# Altium schematic sheet LED_Drivers.SchDoc: LED Drivers
size B; Date: 9/29/2024; Author: Sam Tomlinson; Organization: UWRT; Address1: ADDRESS 1; Address2: ADDRESS 2; Address3: ADDRESS 3; Address4: ADDRESS 4; Revision: -; SheetNumber: 2; SheetTotal: 4; ENG_APP_DATE: --/--/--; DSN_APP_DATE: --/--/--; CHK_APP_DATE: --/--/--; TeamLead: John Ulm
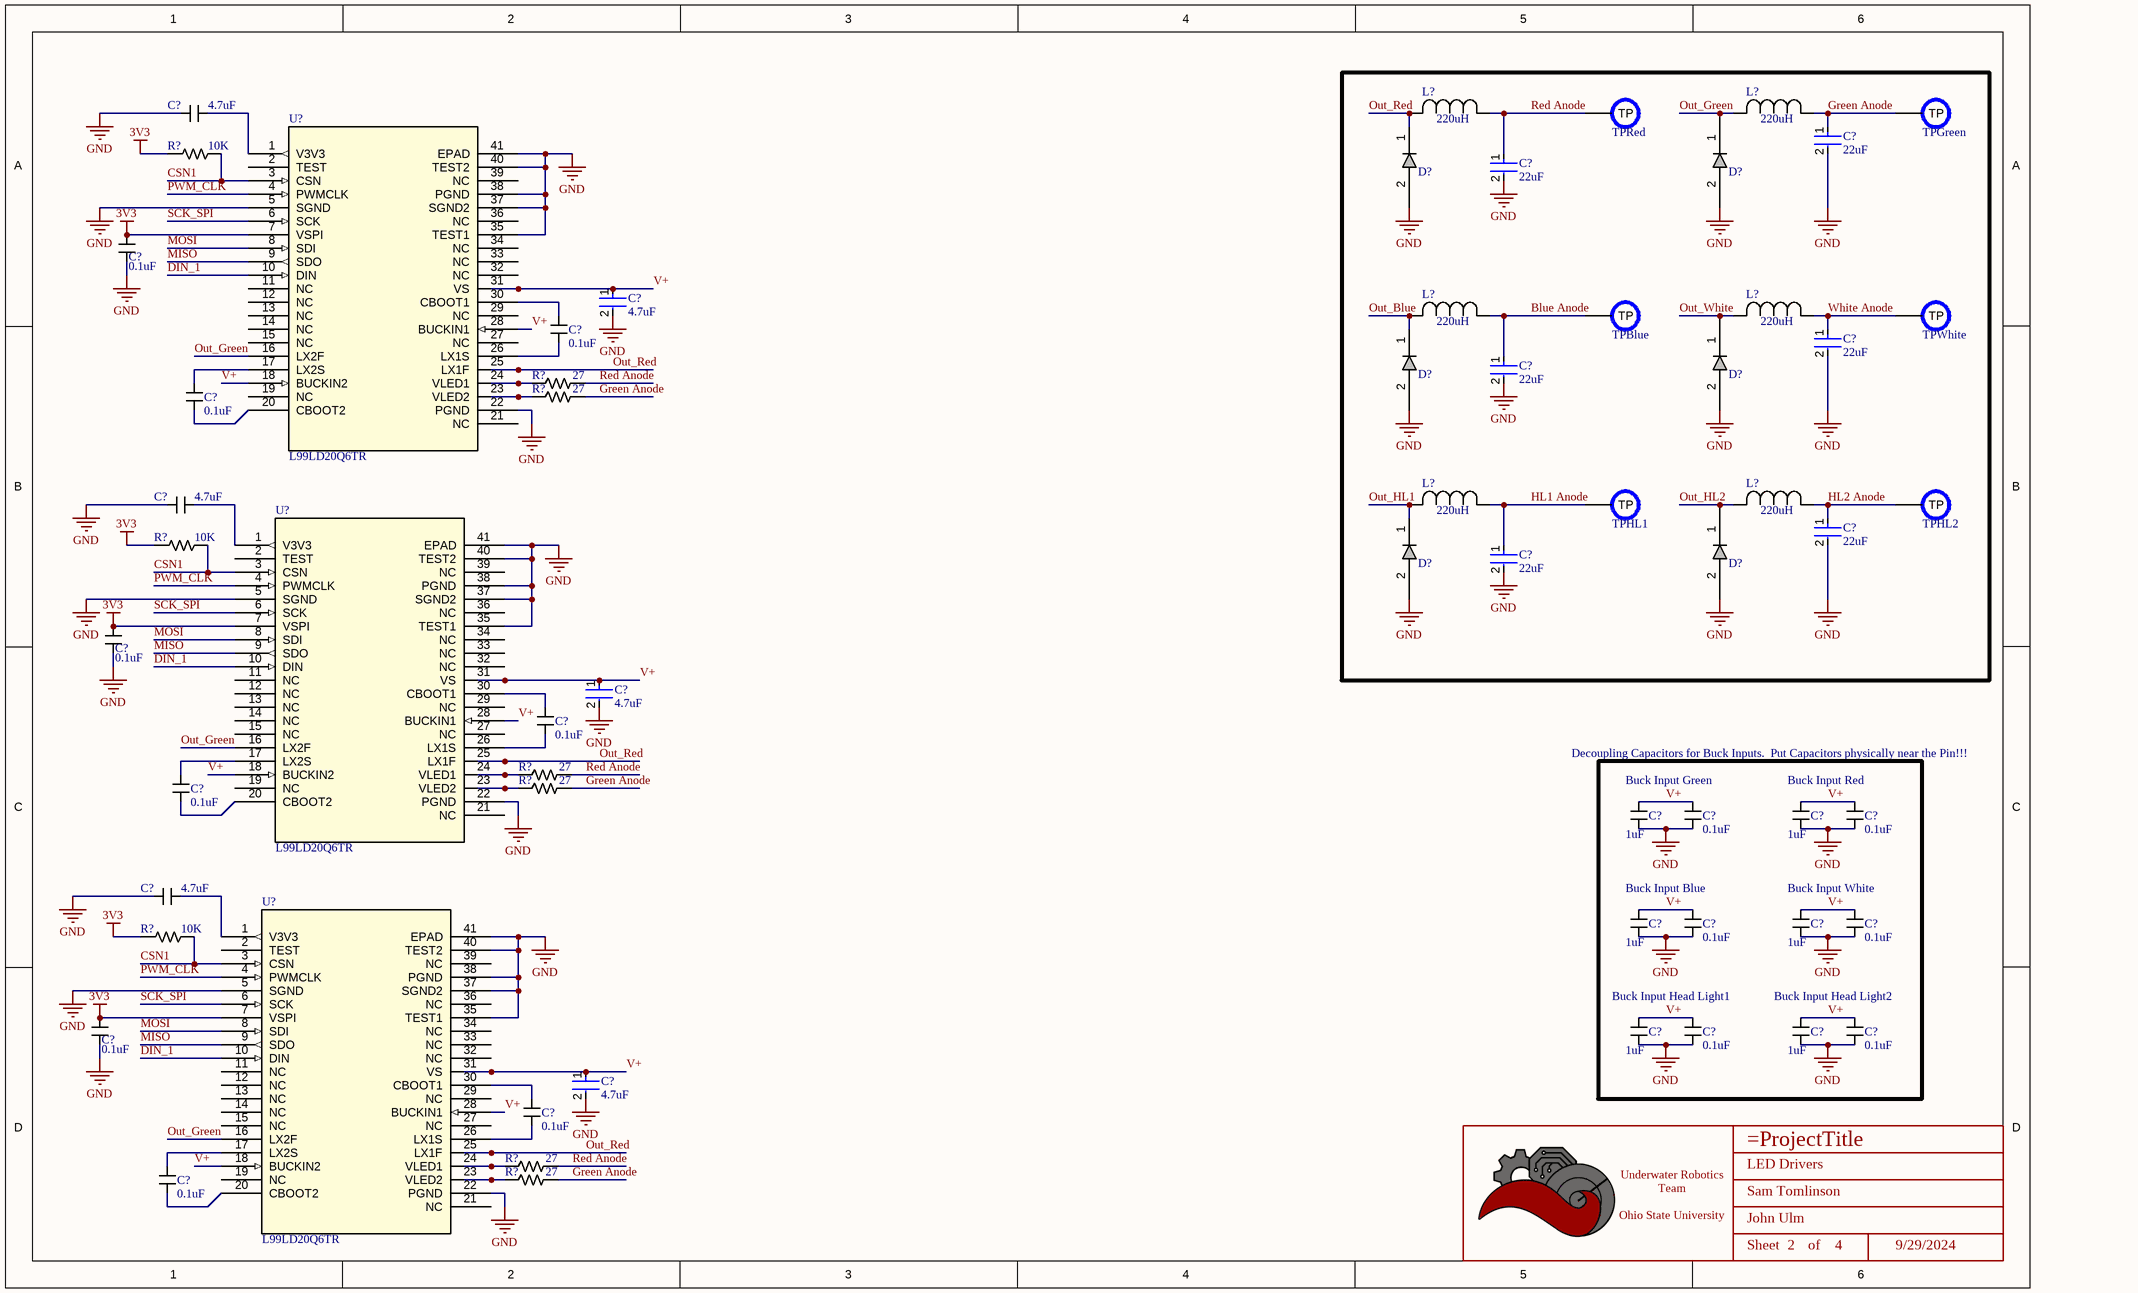
[diagram p0: LED_Drivers.SchDoc]

## Parts
(Parts that share a designator on the sheet are numbered #1, #2 ... from top to bottom, then left to right.)
*  Title_Block  [LOGO]  (value not drawn)  (graphical)
C?#1  value 4.7uF  [CAPACITOR_0603]  (hidden comment: 4.7uF Ceramic 6.3V)
C?#2  22uF  [FP-C2012-125-0_2-MFG]
C?#3  22uF  [FP-C2012-125-0_2-MFG]
C?#4  value 0.1uF  [CAPACITOR_0603]  (hidden comment: 100nF Ceramic 6.3V)
C?#5  4.7uF  [CAPACITOR_0603]
C?#6  value 0.1uF  [CAPACITOR_0603]  (hidden comment: 100nF Ceramic 25V)
C?#7  22uF  [FP-C2012-125-0_2-MFG]
C?#8  22uF  [FP-C2012-125-0_2-MFG]
C?#9  value 0.1uF  [CAPACITOR_0603]  (hidden comment: 100nF Ceramic 25V)
C?#10  value 4.7uF  [CAPACITOR_0603]  (hidden comment: 4.7uF Ceramic 6.3V)
C?#11  22uF  [FP-C2012-125-0_2-MFG]
C?#12  22uF  [FP-C2012-125-0_2-MFG]
C?#13  value 0.1uF  [CAPACITOR_0603]  (hidden comment: 100nF Ceramic 6.3V)
C?#14  4.7uF  [CAPACITOR_0603]
C?#15  value 0.1uF  [CAPACITOR_0603]  (hidden comment: 100nF Ceramic 25V)
C?#16  value 0.1uF  [CAPACITOR_0603]  (hidden comment: 100nF Ceramic 25V)
C?#17  value 1uF  [CAPACITOR_0603]  (hidden comment: 1uF Ceramic 25V)
C?#18  value 0.1uF  [CAPACITOR_0603]  (hidden comment: 100nF Ceramic 25V)
C?#19  value 1uF  [CAPACITOR_0603]  (hidden comment: 1uF Ceramic 25V)
C?#20  value 0.1uF  [CAPACITOR_0603]  (hidden comment: 100nF Ceramic 25V)
C?#21  value 4.7uF  [CAPACITOR_0603]  (hidden comment: 4.7uF Ceramic 6.3V)
C?#22  value 1uF  [CAPACITOR_0603]  (hidden comment: 1uF Ceramic 25V)
C?#23  value 0.1uF  [CAPACITOR_0603]  (hidden comment: 100nF Ceramic 25V)
C?#24  value 1uF  [CAPACITOR_0603]  (hidden comment: 1uF Ceramic 25V)
C?#25  value 0.1uF  [CAPACITOR_0603]  (hidden comment: 100nF Ceramic 25V)
C?#26  value 0.1uF  [CAPACITOR_0603]  (hidden comment: 100nF Ceramic 6.3V)
C?#27  value 1uF  [CAPACITOR_0603]  (hidden comment: 1uF Ceramic 25V)
C?#28  value 0.1uF  [CAPACITOR_0603]  (hidden comment: 100nF Ceramic 25V)
C?#29  value 1uF  [CAPACITOR_0603]  (hidden comment: 1uF Ceramic 25V)
C?#30  value 0.1uF  [CAPACITOR_0603]  (hidden comment: 100nF Ceramic 25V)
C?#31  4.7uF  [CAPACITOR_0603]
C?#32  value 0.1uF  [CAPACITOR_0603]  (hidden comment: 100nF Ceramic 25V)
C?#33  value 0.1uF  [CAPACITOR_0603]  (hidden comment: 100nF Ceramic 25V)
D?#1  CCS15S40,L3F  [SOD-963   CST2C_TOS]  (value not drawn)
D?#2  CCS15S40,L3F  [SOD-963   CST2C_TOS]  (value not drawn)
D?#3  CCS15S40,L3F  [SOD-963   CST2C_TOS]  (value not drawn)
D?#4  CCS15S40,L3F  [SOD-963   CST2C_TOS]  (value not drawn)
D?#5  CCS15S40,L3F  [SOD-963   CST2C_TOS]  (value not drawn)
D?#6  CCS15S40,L3F  [SOD-963   CST2C_TOS]  (value not drawn)
L?#1  SRR1280-221K  [IND_BOURNS_SRR1280]  (value not drawn)
L?#2  SRR1280-221K  [IND_BOURNS_SRR1280]  (value not drawn)
L?#3  SRR1280-221K  [IND_BOURNS_SRR1280]  (value not drawn)
L?#4  SRR1280-221K  [IND_BOURNS_SRR1280]  (value not drawn)
L?#5  SRR1280-221K  [IND_BOURNS_SRR1280]  (value not drawn)
L?#6  SRR1280-221K  [IND_BOURNS_SRR1280]  (value not drawn)
R?#1  Value  (Ohms): 10K  [RESISTOR_0402]  (hidden comment: 10k Ohm 1% 1/16W)
R?#2  Value  (Ohms): 27  [RESISTOR_0603]  (hidden comment: 27 Ohm 5% 1/8W)
R?#3  Value  (Ohms): 27  [RESISTOR_0603]  (hidden comment: 27 Ohm 5% 1/8W)
R?#4  Value  (Ohms): 10K  [RESISTOR_0402]  (hidden comment: 10k Ohm 1% 1/16W)
R?#5  Value  (Ohms): 27  [RESISTOR_0603]  (hidden comment: 27 Ohm 5% 1/8W)
R?#6  Value  (Ohms): 27  [RESISTOR_0603]  (hidden comment: 27 Ohm 5% 1/8W)
R?#7  Value  (Ohms): 10K  [RESISTOR_0402]  (hidden comment: 10k Ohm 1% 1/16W)
R?#8  Value  (Ohms): 27  [RESISTOR_0603]  (hidden comment: 27 Ohm 5% 1/8W)
R?#9  Value  (Ohms): 27  [RESISTOR_0603]  (hidden comment: 27 Ohm 5% 1/8W)
TPBlue  PCB Test Point  [TESTPOINT_1.2MM]  (value not drawn)  (no BOM)
TPGreen  PCB Test Point  [TESTPOINT_1.2MM]  (value not drawn)  (no BOM)
TPHL1  PCB Test Point  [TESTPOINT_1.2MM]  (value not drawn)  (no BOM)
TPHL2  PCB Test Point  [TESTPOINT_1.2MM]  (value not drawn)  (no BOM)
TPRed  PCB Test Point  [TESTPOINT_1.2MM]  (value not drawn)  (no BOM)
TPWhite  PCB Test Point  [TESTPOINT_1.2MM]  (value not drawn)  (no BOM)
U?#1  L99LD20Q6TR  [L99LD20Q6TR]
U?#2  L99LD20Q6TR  [L99LD20Q6TR]
U?#3  L99LD20Q6TR  [L99LD20Q6TR]

## Nets
3V3: C?#4.1 C?#13.1 C?#26.1 R?#1.1 R?#4.1 R?#7.1 U?#1.7(VSPI) U?#2.7(VSPI) U?#3.7(VSPI)
GND: C?#1.2 C?#2.2 C?#3.2 C?#4.2 C?#5.2 C?#7.2 C?#8.2 C?#10.2 C?#11.2 C?#12.2 C?#13.2 C?#14.2 C?#17.1 C?#18.2 C?#19.1 C?#20.2 C?#21.2 C?#22.1 C?#23.2 C?#24.1 C?#25.2 C?#26.2 C?#27.1 C?#28.2 C?#29.1 C?#30.2 C?#31.2 D?#1.2 D?#2.2 D?#3.2 D?#4.2 D?#5.2 D?#6.2 U?#1.5(SGND) U?#1.22(PGND) U?#1.35(TEST1) U?#1.37(SGND2) U?#1.38(PGND) U?#1.40(TEST2) U?#1.41(EPAD) U?#2.5(SGND) U?#2.22(PGND) U?#2.35(TEST1) U?#2.37(SGND2) U?#2.38(PGND) U?#2.40(TEST2) U?#2.41(EPAD) U?#3.5(SGND) U?#3.22(PGND) U?#3.35(TEST1) U?#3.37(SGND2) U?#3.38(PGND) U?#3.40(TEST2) U?#3.41(EPAD)
Blue Anode: C?#8.1 L?#3.1 TPBlue.TP
CSN1: R?#1.2 R?#4.2 R?#7.2 U?#1.3(CSN) U?#2.3(CSN) U?#3.3(CSN)
DIN_1: U?#1.10(DIN) U?#2.10(DIN) U?#3.10(DIN)
Green Anode: C?#2.1 L?#2.1 R?#3.1 R?#6.1 R?#9.1 TPGreen.TP
HL1 Anode: C?#12.1 L?#5.1 TPHL1.TP
HL2 Anode: C?#11.1 L?#6.1 TPHL2.TP
MISO: U?#1.9(SDO) U?#2.9(SDO) U?#3.9(SDO)
MOSI: U?#1.8(SDI) U?#2.8(SDI) U?#3.8(SDI)
Out_Blue: D?#3.1 L?#3.2
Out_Green: D?#2.1 L?#2.2 U?#1.16(LX2F) U?#2.16(LX2F) U?#3.16(LX2F)
Out_HL1: D?#5.1 L?#5.2
Out_HL2: D?#6.1 L?#6.2
Out_Red: D?#1.1 L?#1.2 U?#1.25(LX1F) U?#2.25(LX1F) U?#3.25(LX1F)
Out_White: D?#4.1 L?#4.2
PWM_CLK: U?#1.4(PWMCLK) U?#2.4(PWMCLK) U?#3.4(PWMCLK)
Red Anode: C?#3.1 L?#1.1 R?#2.1 R?#5.1 R?#8.1 TPRed.TP
SCK_SPI: U?#1.6(SCK) U?#2.6(SCK) U?#3.6(SCK)
V+: C?#5.1 C?#14.1 C?#17.2 C?#18.1 C?#19.2 C?#20.1 C?#22.2 C?#23.1 C?#24.2 C?#25.1 C?#27.2 C?#28.1 C?#29.2 C?#30.1 C?#31.1 U?#1.18(BUCKIN2) U?#1.28(BUCKIN1) U?#1.31(VS) U?#2.18(BUCKIN2) U?#2.28(BUCKIN1) U?#2.31(VS) U?#3.18(BUCKIN2) U?#3.28(BUCKIN1) U?#3.31(VS)
White Anode: C?#7.1 L?#4.1 TPWhite.TP
NetC?#1_1: C?#1.1 U?#1.1(V3V3)
NetC?#6_1: C?#6.1 U?#1.30(CBOOT1)
NetC?#6_2: C?#6.2 U?#1.26(LX1S)
NetC?#9_1: C?#9.1 U?#1.20(CBOOT2)
NetC?#9_2: C?#9.2 U?#1.17(LX2S)
NetC?#10_1: C?#10.1 U?#2.1(V3V3)
NetC?#15_1: C?#15.1 U?#2.30(CBOOT1)
NetC?#15_2: C?#15.2 U?#2.26(LX1S)
NetC?#16_1: C?#16.1 U?#2.20(CBOOT2)
NetC?#16_2: C?#16.2 U?#2.17(LX2S)
NetC?#21_1: C?#21.1 U?#3.1(V3V3)
NetC?#32_1: C?#32.1 U?#3.30(CBOOT1)
NetC?#32_2: C?#32.2 U?#3.26(LX1S)
NetC?#33_1: C?#33.1 U?#3.20(CBOOT2)
NetC?#33_2: C?#33.2 U?#3.17(LX2S)
NetR?#2_2: R?#2.2 U?#1.24(VLED1)
NetR?#3_2: R?#3.2 U?#1.23(VLED2)
NetR?#5_2: R?#5.2 U?#2.24(VLED1)
NetR?#6_2: R?#6.2 U?#2.23(VLED2)
NetR?#8_2: R?#8.2 U?#3.24(VLED1)
NetR?#9_2: R?#9.2 U?#3.23(VLED2)

Not connected (* = marked no-connect by the designer): U?#1 2(TEST) 11(NC) 12(NC) 13(NC) 14(NC) 15(NC) 19(NC) 21(NC) 27(NC) 29(NC) 32(NC) 33(NC) 34(NC) 36(NC) 39(NC); U?#2 2(TEST) 11(NC) 12(NC) 13(NC) 14(NC) 15(NC) 19(NC) 21(NC) 27(NC) 29(NC) 32(NC) 33(NC) 34(NC) 36(NC) 39(NC); U?#3 2(TEST) 11(NC) 12(NC) 13(NC) 14(NC) 15(NC) 19(NC) 21(NC) 27(NC) 29(NC) 32(NC) 33(NC) 34(NC) 36(NC) 39(NC)

## Notes on the sheet
- (near C?#17) Decoupling Capacitors for Buck Inputs.  Put Capacitors physically near the Pin!!!
- (near C?#17) Buck Input Green
- (near C?#19) Buck Input Red
- (near C?#22) Buck Input Blue
- (near C?#24) Buck Input White
- (near C?#27) Buck Input Head Light1
- (near C?#29) Buck Input Head Light2
- DWG. NO.
- REV.
- SHT.
- THIS DOCUMENT AND THE DATA DISCLOSED HEREIN OR HEREWITH IS THE PROPERTY OF ALTIUM LIMITED AND MAY BE FREELY DISTRIBUTED IN WHOLE. NO RIGHTS ARE RESERVED OR EXPRESS OR IMPLIED WARANTEE GIVEN.
- REVISION
- DESCRIPTION
- DATE
- APPROVED
- ENG:
- APPROVALS
- PROJECT
- DSN:
- CHK:
- REFERENCE DOCUMENTS
- PROJECT REVISION:
- TITLE
- DOCUMENT REVISION:
- DESIGN ITEM:
- BOM:
- FAB DWG:
- PCB DWG:
- ASSY DWG:
- SCALE:
- SIZE
- B
- CAGE CODE
- FILE NAME
- DWG NO.
- SHEET
- OF
- REV
- (in symbol INDUCTOR_SRR1280-221K) 220uH
- (in symbol Title_Block) Underwater Robotics Team / Ohio State University; Sheet; of

## Library data of the parts
* = Title_Block: UWRT Schematic Title Block Template / Created June 2021, Dylan Trainor
C?#1 C?#10 C?#21 = CAPACITOR_4.7uF_0603: Cap 4.7uF 6.3V +/-10% / Ceramic 0603; Made By: Robert Pafford; Tolerance: +/- 10%; Voltage: 6.3V; Supplier 1: Digi-Key; Supplier Part Number 1: 1276-2087-1-ND
C?#2 C?#3 C?#7 C?#8 C?#11 C?#12 = CMP-2000-06038-3: Multilayer Ceramic Capacitors 22μF ±20% 35V X5R SMD 0805; Tolerance: 20%; RoHS Compliant: Yes; Height: 1.25mm; Termination: SMD/SMT; Case/Package: 0805; Thickness: 0.057inch; Max Operating Temperature: 85°C; Min Operating Temperature: -55°C; Voltage Rating (DC): 35V; Length: 0.079inch; Dielectric: X5R; Dielectric Material: Ceramic; Capacitance: 22uF; Voltage Rating: 35V; Mount: Surface Mount; Package Quantity: 2000; Lead Free: Lead Free; Weight: 0.000194oz; REACH SVHC: No SVHC; Width: 0.049inch; Packaging: Tape and Reel; Series: C; Case Code (Metric): 2012; Case Code (Imperial): 0805
C?#4 C?#13 C?#26 = CAPACITOR_0.1uF_0603_1: Cap 100nF 6.3V +/-10% / Ceramic 0603; Made By: Flip B; ComponentLink1Description: Datsheet; ComponentLink1URL: https://www.mouser.com/datasheet/2/212/KEM_C1002_X7R_SMD-1102033.pdf; Tolerance: +/- 10%; Voltage: 6.3V; Supplier 1: Digi-Key; Supplier Part Number 1: 399-15351-1-ND
C?#5 C?#14 C?#31 = CAP CERM 4.7UF 20% 35V: Chip Multilayer Ceramic Capacitors for General Purpose, 0603, 4.7uF, X5R, 15%, 20%, 35V; Voltage Rating (DC): 35V; Capacitance: 4.7uF; Dielectric: X5R; Case/Package: 0603; Min Operating Temperature: -55°C; Weight: 0.000222oz; Tolerance: 20%; Termination: SMD/SMT; Case Code (Imperial): 0603; Resistor Type: Ceramic; Thickness: 0.039inch; Case Code (Metric): 1608; Width: 0.8mm; Max Operating Temperature: 85°C; Mount: Surface Mount; Length: 0.063inch; Package Quantity: 4000; Height: 0.8mm; Voltage Rating: 35V; Packaging: Tape and Reel; Supplier 1: Arrow Electronics; Supplier Part Number 1: GRM188R6YA475ME15D
C?#6 C?#9 C?#15 C?#16 C?#18 C?#20 C?#23 C?#25 C?#28 C?#30 C?#32 C?#33 = CAPACITOR_0.1uF_0603_25V: Cap 100nF 25V +/-10% / Ceramic 0603; Voltage: 6.3V; Made By: Flip B; ComponentLink1Description: Datsheet; ComponentLink1URL: https://www.mouser.com/datasheet/2/212/KEM_C1002_X7R_SMD-1102033.pdf; Tolerance: +/- 10%; Supplier 1: Digikey; Supplier Part Number 1: 1276-1006-1-ND
C?#17 C?#19 C?#22 C?#24 C?#27 C?#29 = CAPACITOR_1uF_0603_25V: Cap 1uF 25V +/-10% / Ceramic 0603; Voltage: 16V; Made By: Flip B; Tolerance: +/- 10%; Supplier 1: Digikey; Supplier Part Number 1: 1276-1102-1-ND
D?#1-D?#6 = SCHOTTKY_40V_1.5A: DIODE SCHOTTKY 40V 1.5A CST2C; Mfr_Name: Toshiba Electronic Devices & Storage Corp.; Type: DEV; Copyright: Copyright (C) 2023 Ultra Librarian. All rights reserved.; Manufacturer_Part_Number: CCS15S40,L3F; RefDes: RefDes; Supplier 1: Digi-Key; Supplier Part Number 1: CCS15S40L3FCT-ND
L?#1-L?#6 = INDUCTOR_SRR1280-221K: 220 µH Shielded Drum Core, Wirewound Inductor 1.6 A 400mOhm Max Nonstandard; Mfr_Name: Bourns Electronics; Type: DEV; Copyright: Copyright (C) 2023 Ultra Librarian. All rights reserved.; Manufacturer_Part_Number: SRR1280-221K; RefDes: RefDes; Supplier 1: Digi-Key; Supplier Part Number 1: SRR1280-221KLCT-ND
R?#1 R?#4 R?#7 = RESISTOR_10K_0402: RES 10k OHM 1% 1/16W 0402; Tolerance: +/- 1%; Made By: Robert Pafford; Wattage: 1/16W; Supplier: Digikey; Digikey Part Numer: CR0603-JW-104ELFTR-ND; Supplier 1: Digi-Key; Supplier Part Number 1: YAG3436CT-ND
R?#2 R?#3 R?#5 R?#6 R?#8 R?#9 = RESISTOR_27_0603: RES 27 OHM 5% 1/8W 0603; Tolerance: +/- 5%; Made By: Robert Pafford; ComponentLink1Description: Datasheet; ComponentLink1URL: https://www.bourns.com/docs/product-datasheets/CRxxxxx.pdf; Wattage: 1/8W; Supplier: Digikey; Digikey Part Numer: CR0603-JW-104ELFTR-ND; Supplier 1: Digi-Key; Supplier Part Number 1: 2019-RK73B1JTTD270JCT-ND
TPBlue TPGreen TPHL1 TPHL2 TPRed TPWhite = TESTPOINT: Made By: Robert Pafford
U?#1-U?#3 = L99LD20Q6TR: IC LED DRVR RGLTR PWM 1.5A 40QFN; Mfr_Name: STMicroelectronics; Copyright: Copyright (C) 2023 Ultra Librarian. All rights reserved.; Manufacturer_Part_Number: L99LD20Q6TR; RefDes: RefDes; Type: DEV; Supplier 1: Digi-Key; Supplier Part Number 1: 497-18126-1-ND